# Altium schematic sheet THERMAL.SchDoc
size A; SheetNumber: 3; SheetTotal: 5
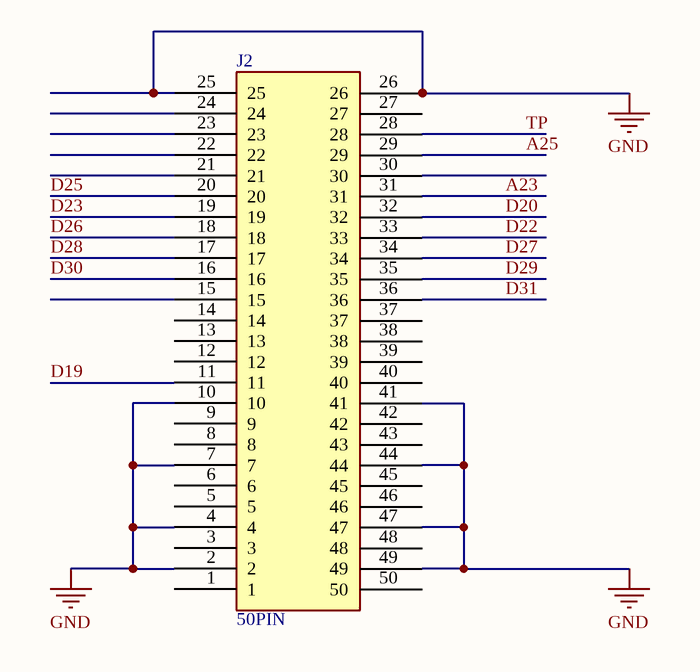
[diagram p0: THERMAL.SchDoc]

## Parts
J2  50PIN

## Nets
GND: J2.2 J2.4 J2.7 J2.10 J2.25 J2.26 J2.41 J2.44 J2.47 J2.49
A23: J2.31
A25: J2.29
D19: J2.11
D20: J2.32
D22: J2.33
D23: J2.19
D25: J2.20
D26: J2.18
D27: J2.34
D28: J2.17
D29: J2.35
D30: J2.16
D31: J2.36
TP: J2.28

Not connected (* = marked no-connect by the designer): J2 1 3 5 6 8 9 12 13 14 15 21 22 23 24 27 30 37 38 39 40 42 43 45 46 48 50